# EAGLE design transmitter_new (EAGLE 9.6.2)
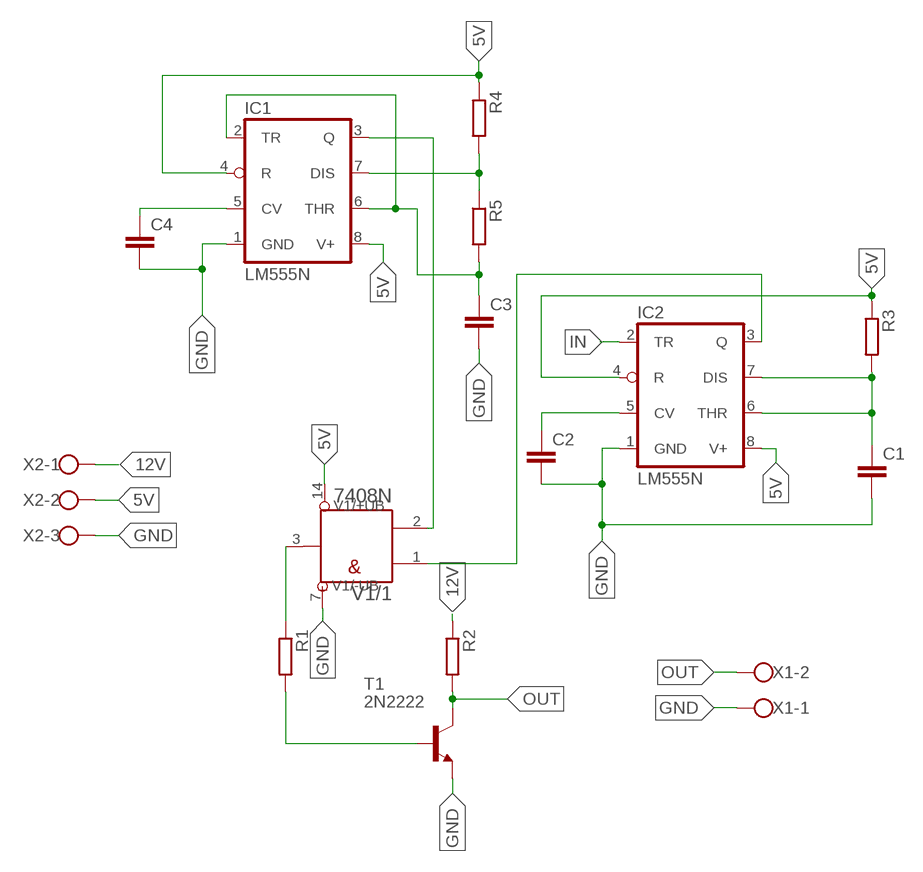
[diagram p0: schematic, sheet 1]

## Parts
C1  C-EU050-025X075  [C050-025X075]
C2  C-EU050-025X075  [C050-025X075]
C3  C-EU050-025X075  [C050-025X075]
C4  C-EU050-025X075  [C050-025X075]
IC1  LM555N  [DIL08]
IC2  LM555N  [DIL08]
R1  R-EU_0207/10  [0207/10]
R2  R-EU_0207/10  [0207/10]
R3  R-EU_0207/10  [0207/10]
R4  R-EU_0207/10  [0207/10]
R5  R-EU_0207/10  [0207/10]
T1  2N2222  [TO18]
V1  7408N  [DIL14]
X1  W237-102  [W237-102]
X2  W237-103  [W237-103]

## Nets
5V: IC1.4(R) IC1.8(V+) IC2.4(R) IC2.8(V+) R3.1 R4.1 V1.14(/+UB:+UB) X2.2
12V: R2.1 X2.1
GND: C1.2 C2.2 C3.2 C4.2 IC1.1(GND) IC2.1(GND) T1.1(E) V1.7(/-UB:-UB) X1.1 X2.3
IN: IC2.2(TR)
N$1: IC1.7(DIS) R4.2 R5.1
N$2: C3.1 IC1.2(TR) IC1.6(THR) R5.2
N$3: C4.1 IC1.5(CV)
N$4: IC1.3(Q) V1.2(/1:B)
N$5: C2.1 IC2.5(CV)
N$6: C1.1 IC2.6(THR) IC2.7(DIS) R3.2
N$7: R1.1 V1.3(/1:Y)
N$8: IC2.3(Q) V1.1(/1:A)
N$9: R1.2 T1.2(B)
OUT: R2.2 T1.3(C) X1.2
Unconnected: V1.4(/2:A) V1.5(/2:B) V1.6(/2:Y) V1.8(/3:Y) V1.9(/3:A) V1.10(/3:B) V1.11(/4:Y) V1.12(/4:A) V1.13(/4:B)

## Library data of the parts
C1-C4 = rcl:C-EU: CAPACITOR, European symbol; SPICEPREFIX: C
IC1 IC2 = linear:*555: TIMER
R1-R5 = rcl:R-EU_: RESISTOR, European symbol; SPICEPREFIX: R
T1 = transistor:2N2222: NPN TRANSISTOR
V1 = 74ttl-din:74*08: Quad 2-input AND gate
X1 = con-wago-500:W237-102: WAGO SCREW CLAMP; MPN: 237-102; OC_FARNELL: unknown; OC_NEWARK: 70K9898
X2 = con-wago-500:W237-103: WAGO SCREW CLAMP; MPN: 237-103; OC_FARNELL: unknown; OC_NEWARK: 18M7116

## Board
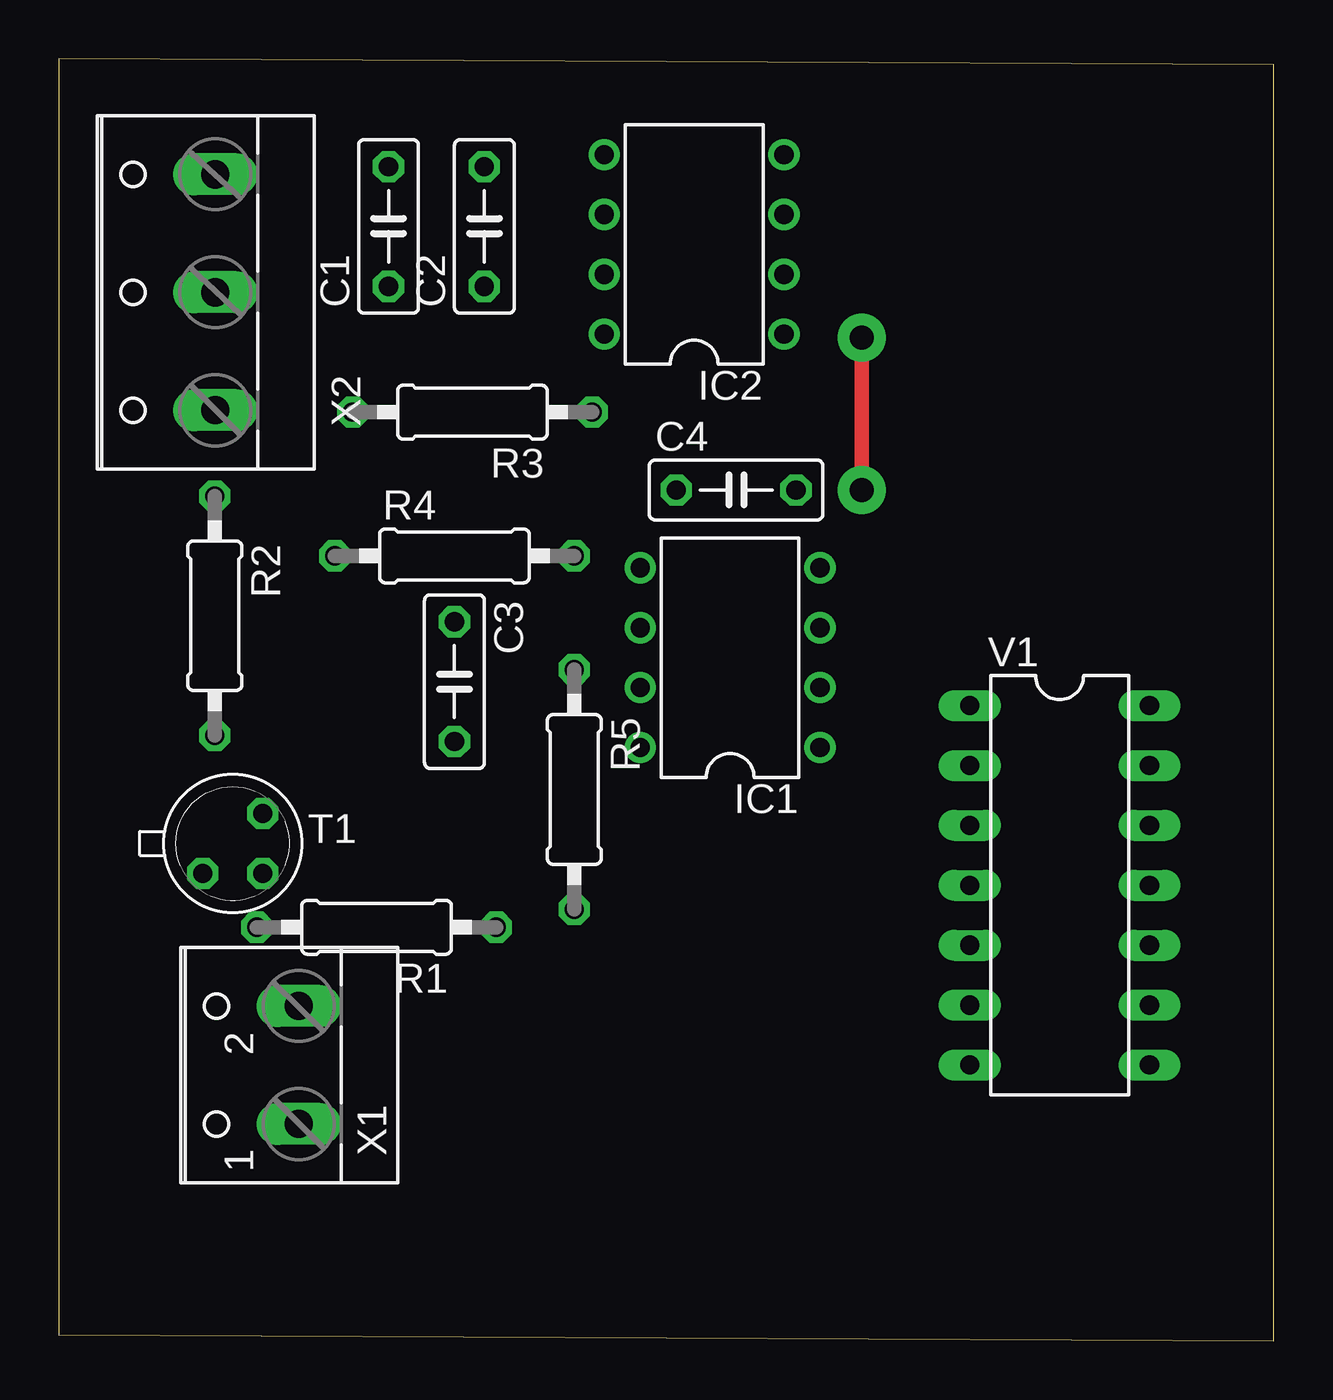
[diagram p1: board, top side]
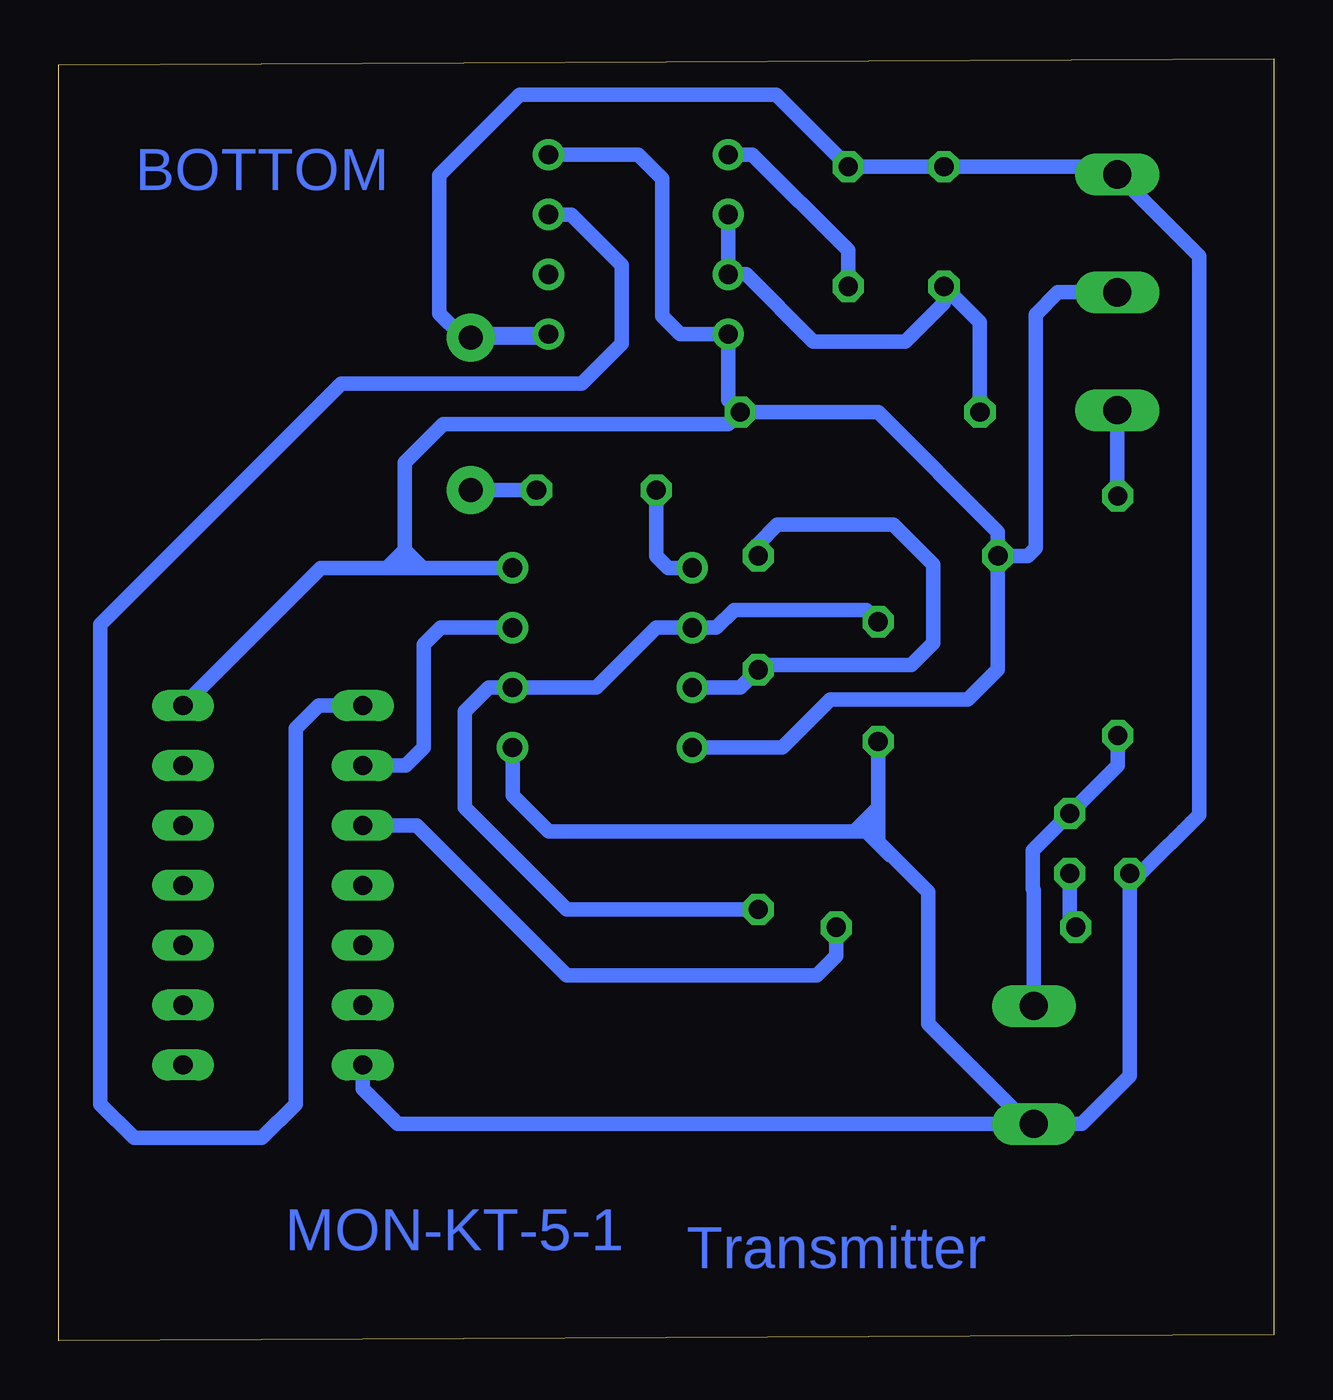
[diagram p2: board, bottom side, seen from below]

Size 51.49 x 54.35 mm. Coordinates in mm from the lower left corner, seen from the top.
Outline: 0,0.25 51.49,0 51.49,54.09 0,54.35 0,0.25
Copper layers (1*16): Top 0.035mm / dielectric 1.5mm / Bottom 0.035mm
Design rules "default *": minimum track width 24mil, minimum drill 0.35mm, track to track 24mil, track to pad 24mil, pad to pad 24mil, via to via 24mil, smd to smd 24mil, copper to edge 40mil, drill to drill 24mil, minimum pad ring 10mil, minimum via ring 8mil, stop-mask expansion 4mil, vias tented up to drill 0mil, thermal gap 10mil

### Footprints (pad centres in the part's own frame; a part is rotated, then mirrored left to right if it is on the bottom)
C050-025X075 = drill 0.813 octagon: 1 -2.54,0; 2 2.54,0
DIL08 = drill 0.813 pad 1.27: 1 -3.81,-3.81; 2 -1.27,-3.81; 3 1.27,-3.81; 4 3.81,-3.81; 5 3.81,3.81; 6 1.27,3.81; 7 -1.27,3.81; 8 -3.81,3.81
0207/10 = drill 0.813 octagon: 1 -5.08,0; 2 5.08,0
TO18 = drill 0.813 octagon: 1 -1.27,-1.27; 2 1.27,-1.27; 3 1.27,1.27
DIL14 = drill 0.813 long: 1 -7.62,-3.81; 2 -5.08,-3.81; 3 -2.54,-3.81; 4 0,-3.81; 5 2.54,-3.81; 6 5.08,-3.81; 7 7.62,-3.81; 8 7.62,3.81; 9 5.08,3.81; 10 2.54,3.81; 11 0,3.81; 12 -2.54,3.81; 13 -5.08,3.81; 14 -7.62,3.81
W237-102 = drill 1.194 long: 1 -2.5,-1.27; 2 2.5,-1.27
W237-103 = drill 1.194 long: 1 -5,-1.29; 2 0,-1.29; 3 5,-1.29

### Placement (x,y rotation side)
C1  13.97,47.24 90 top
C2  18.03,47.24 90 top
C3  16.76,27.94 270 top
C4  28.7,36.07 0 top
IC1  28.45,28.96 90 top
IC2  26.92,46.48 90 top
R1  13.46,17.53 180 top
R2  6.6,30.73 270 top
R3  17.53,39.37 180 top
R4  16.76,33.27 0 top
R5  21.84,23.37 270 top
T1  7.37,21.08 0 top
V1  42.42,19.3 270 top
X1  8.89,11.68 90 top
X2  5.33,44.45 90 top

### Tracks (layer width: path | path; a pad name or v marks a point on that pad's centre or on a via)
5V
  Bottom 0.61: X2.2 9.14,44.45 10.09,43.5 10.09,33.6 10.41,33.27 R4.1 | R3.1 23.11,39.88 IC2.8 25.15,42.67 25.91,43.43 25.91,49.28 26.92,50.29 IC2.4 | R3.1 16.76,39.37 11.68,34.29 R4.1 | IC1.8 20.83,25.15 18.8,27.18 12.95,27.18 11.68,28.45 R4.1 | R3.1 23.11,38.86 35.19,38.86 36.83,37.22 36.83,33.53 | 36.83,33.53 36.83,32.77 | 36.07,32.77 36.83,32.77 | IC1.4 36.07,32.77 | 36.83,32.77 37.59,32.77 | 37.59,32.77 40.39,32.77 V1.14 | 36.07,32.77 36.83,33.53 | 36.83,33.53 37.59,32.77
12V
  Bottom 0.61: X2.1 6.62,35.83 R2.1
GND  (via drill 1.02 pad 2.03)
  Top 0.61: v34.04,36.07 v34.04,42.52
  Bottom 0.61: T1.1 6.1,11.22 8.13,9.18 X1.1 | T1.1 6.41,19.81 | T1.1 5.64,19.81 3.16,22.3 3.16,45.98 X2.3 6.96,49.78 C1.2 C2.2 21.08,52.83 31.95,52.83 35.36,49.42 35.36,43.54 34.48,42.67 IC2.1 30.89,42.52 v34.04,42.52 | V1.7 38.61,10.67 37.12,9.18 X1.1 | X1.1 10.56,8.78 10.56,9.35 14.64,13.43 14.64,19.02 16.76,21.14 16.76,21.59 | 16.76,21.59 16.76,22.61 | 16.76,22.61 C3.2 | IC1.1 32.26,23.11 30.73,21.59 17.78,21.59 | 17.78,21.59 17.27,21.59 | 17.27,21.59 16.76,21.59 | 16.76,22.61 17.78,21.59 | 16.26,20.57 17.27,21.59 | C4.2 v34.04,36.07
N$1
  Bottom 0.61: R4.2 21.84,33.78 21.03,34.59 16.11,34.59 14.43,32.91 14.43,29.57 15.35,28.65 21.64,28.65 R5.1 22.61,27.69 IC1.7
N$2
  Bottom 0.61: R5.2 29.97,18.29 34.29,22.61 34.29,26.67 33.27,27.69 IC1.2 28.7,27.69 26.16,30.23 IC1.6 23.62,30.23 22.86,30.99 17.27,30.99 C3.1
N$3
  Bottom 0.61: IC1.5 25.65,32.77 26.16,33.27 C4.1
N$4
  Bottom 0.61: IC1.3 35.31,30.23 36.02,29.52 36.02,25.15 36.78,24.38 V1.2
N$5
  Bottom 0.61: C2.1 18.03,46.23 22.1,50.29 IC2.5
N$6
  Bottom 0.61: R3.2 12.45,43.18 C1.1 13.97,44 15.6,42.37 19.51,42.37 22.35,45.21 IC2.7 IC2.6
N$7
  Bottom 0.61: V1.3 36.32,21.84 29.97,15.49 19.36,15.49 18.54,16.32 R1.1
N$8
  Bottom 0.61: IC2.3 29.78,47.75 27.64,45.61 27.64,42.27 29.32,40.59 39.51,40.59 49.73,30.37 49.73,10.02 48.3,8.58 42.88,8.58 41.45,10.02 41.45,25.95 40.48,26.92 V1.1
N$9
  Bottom 0.61: T1.2 8.64,17.78 R1.2
OUT
  Bottom 0.61: R2.2 6.6,24.38 T1.3 10.21,20.78 10.21,19.16 10.16,19.11 X1.2

### Text on the board
Bottom: BOTTOM | MON-KT-5-1 | Transmitter